# Altium schematic sheet MB_RF.SchDoc
size 420 x 297 mm; Date: 18/12/2022; ApprovedBy: UA3REO; CheckedBy: UA3REO; Author: RU4PN; CompanyName: Wolf Team; DocumentNumber: Wolf2 MainBoard RF; SheetNumber: 6; SheetTotal: 7
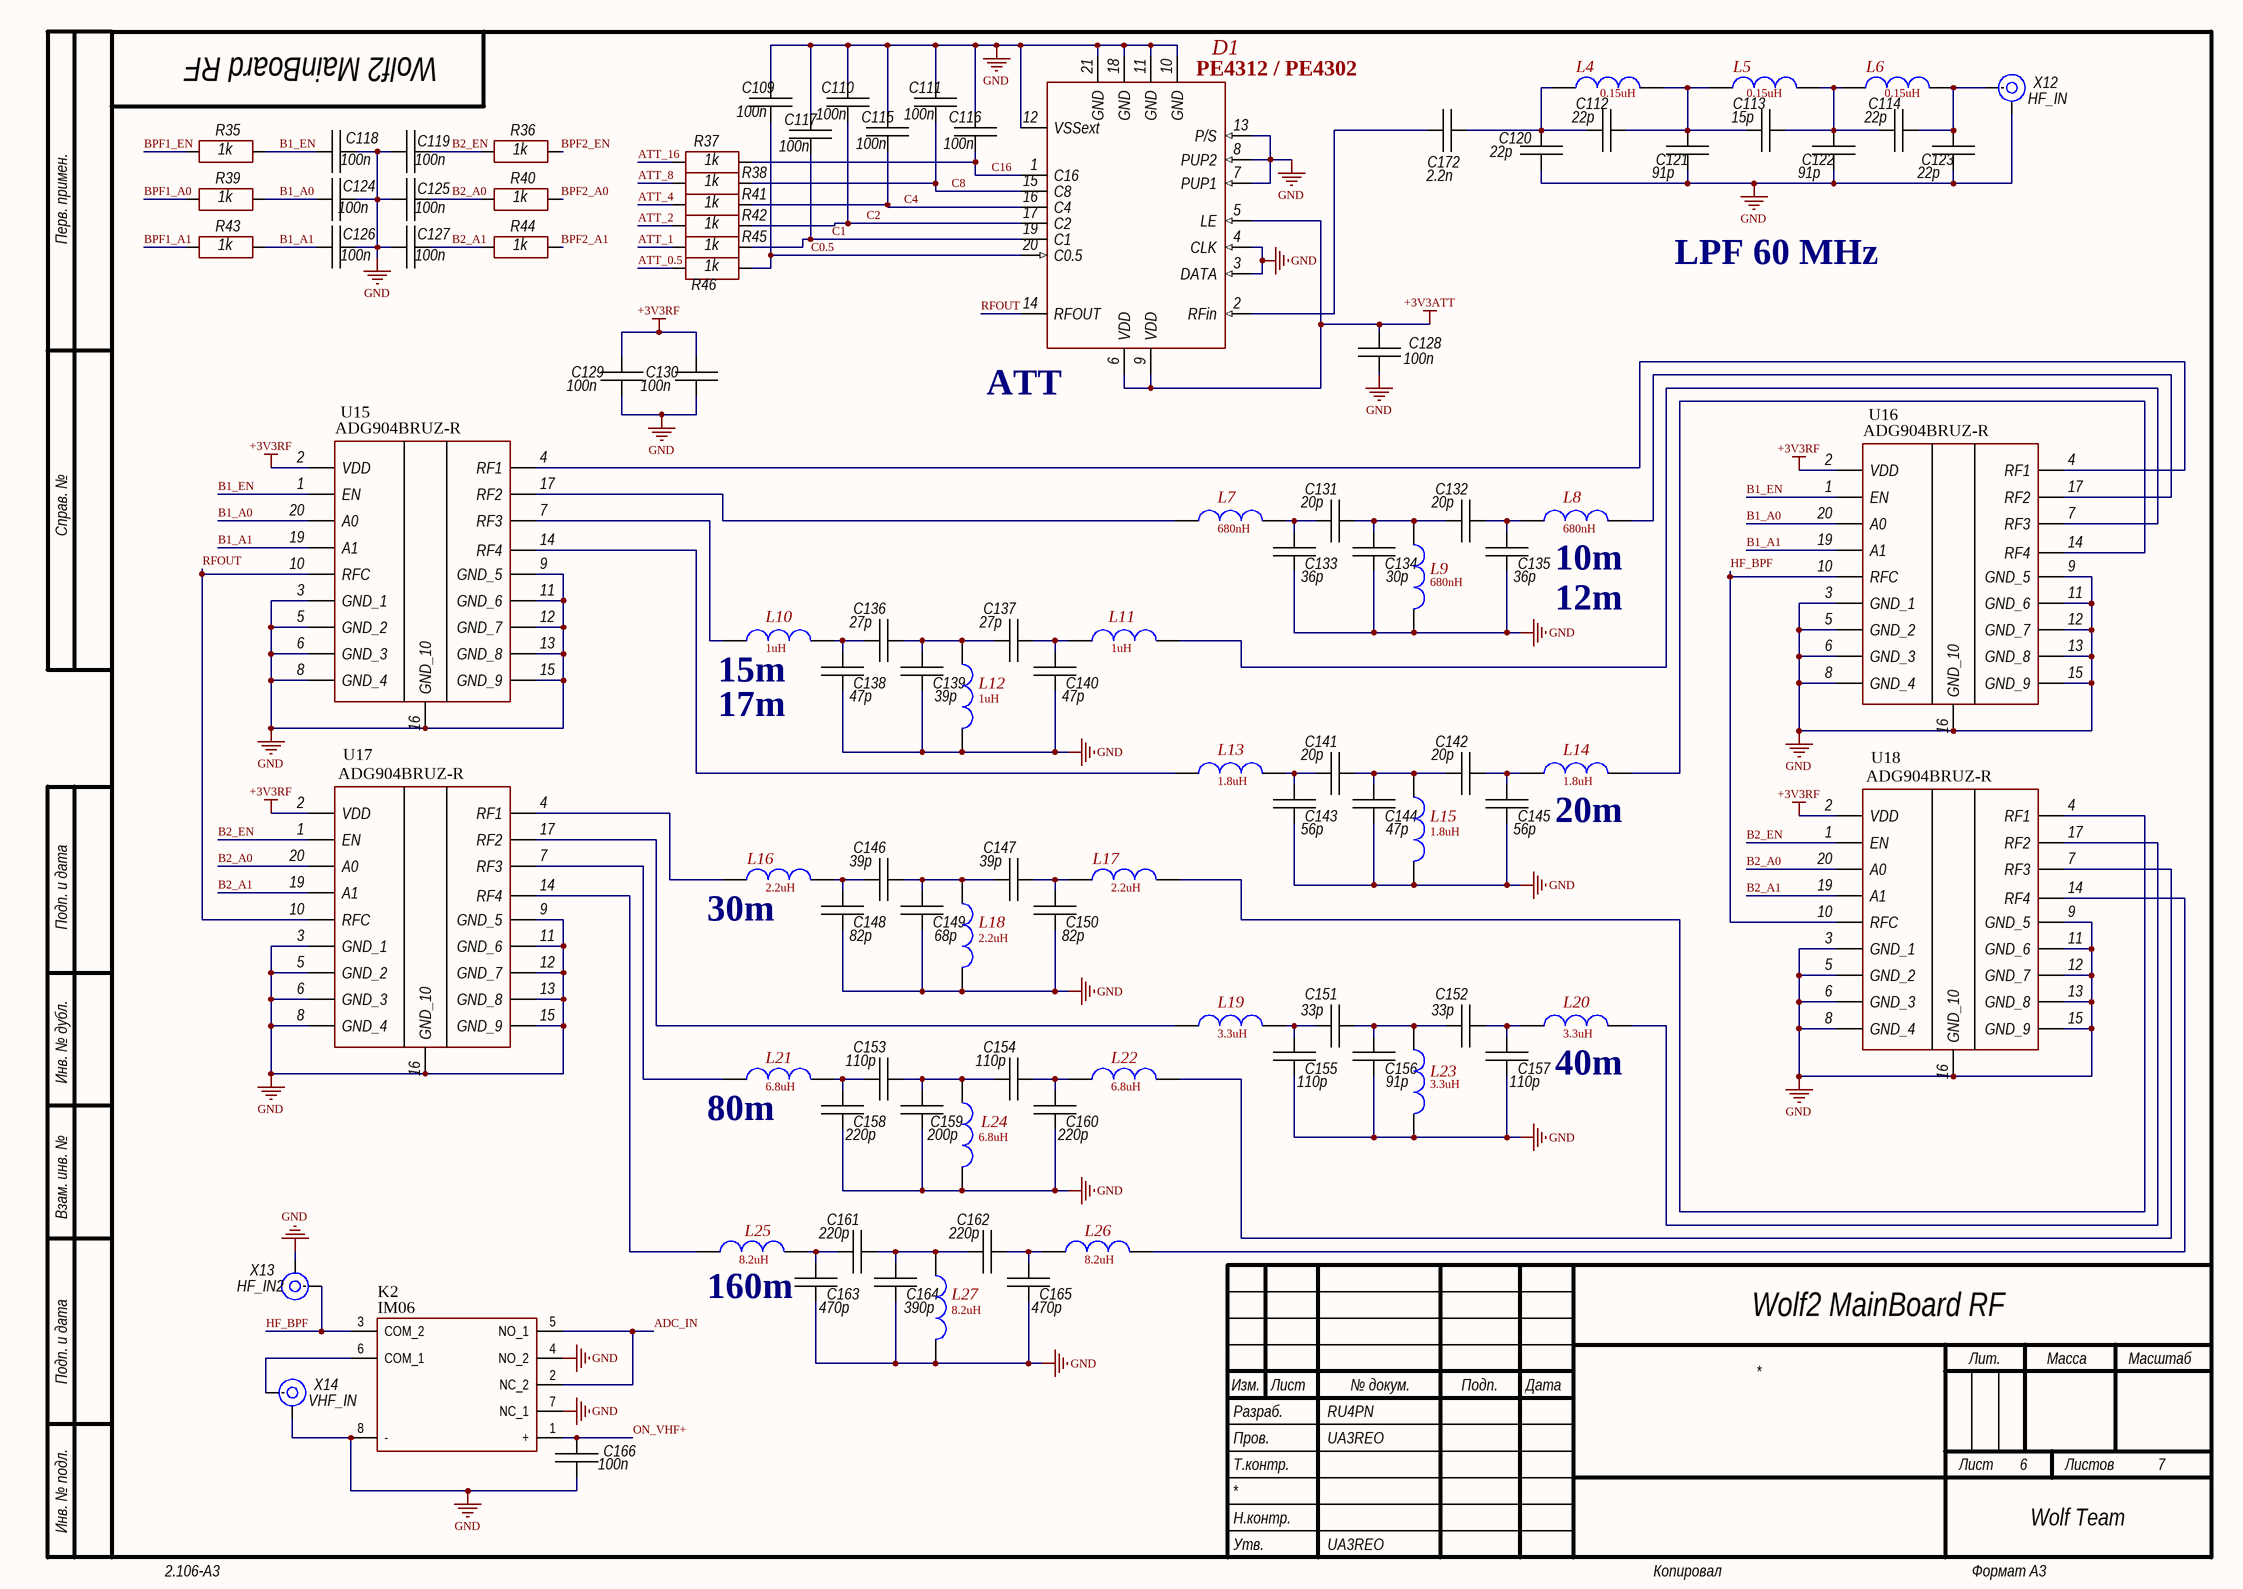
[diagram p0: MB_RF.SchDoc]

## Parts
C109  100n  [CH0805C]
C110  100n  [CH0805C]
C111  100n  [CH0805C]
C112  22p  [CH0805C]
C113  15p  [CH0805C]
C114  22p  [CH0805C]
C115  100n  [CH0805C]
C116  100n  [CH0805C]
C117  100n  [CH0805C]
C118  100n  [CH0805C]
C119  100n  [CH0805C]
C120  22p  [CH0805C]
C121  91p  [CH0805C]
C122  91p  [CH0805C]
C123  22p  [CH0805C]
C124  100n  [CH0805C]
C125  100n  [CH0805C]
C126  100n  [CH0805C]
C127  100n  [CH0805C]
C128  100n  [CH0805C]
C129  100n  [CH0805C]
C130  100n  [CH0805C]
C131  20p  [CH0805C]
C132  20p  [CH0805C]
C133  36p  [CH0805C]
C134  30p  [CH0805C]
C135  36p  [CH0805C]
C136  27p  [CH0805C]
C137  27p  [CH0805C]
C138  47p  [CH0805C]
C139  39p  [CH0805C]
C140  47p  [CH0805C]
C141  20p  [CH0805C]
C142  20p  [CH0805C]
C143  56p  [CH0805C]
C144  47p  [CH0805C]
C145  56p  [CH0805C]
C146  39p  [CH0805C]
C147  39p  [CH0805C]
C148  82p  [CH0805C]
C149  68p  [CH0805C]
C150  82p  [CH0805C]
C151  33p  [CH0805C]
C152  33p  [CH0805C]
C153  110p  [CH0805C]
C154  110p  [CH0805C]
C155  110p  [CH0805C]
C156  91p  [CH0805C]
C157  110p  [CH0805C]
C158  220p  [CH0805C]
C159  200p  [CH0805C]
C160  220p  [CH0805C]
C161  220p  [CH0805C]
C162  220p  [CH0805C]
C163  470p  [CH0805C]
C164  390p  [CH0805C]
C165  470p  [CH0805C]
C166  100n  [CH0805C]
C172  2.2n  [CH0805C]
D1  PE4312 / PE4302  [20-QFN (4x4)]
K2  IM06  [IM06]
L4  0.15uH  [CH0805L]
L5  0.15uH  [CH0805L]
L6  0.15uH  [CH0805L]
L7  680nH  [CH0805L]
L8  680nH  [CH0805L]
L9  680nH  [CH0805L]
L10  1uH  [CH0805L]
L11  1uH  [CH0805L]
L12  1uH  [CH0805L]
L13  1.8uH  [CH0805L]
L14  1.8uH  [CH0805L]
L15  1.8uH  [CH0805L]
L16  2.2uH  [CH0805L]
L17  2.2uH  [CH0805L]
L18  2.2uH  [CH0805L]
L19  3.3uH  [CH0805L]
L20  3.3uH  [CH0805L]
L21  6.8uH  [CH0805L]
L22  6.8uH  [CH0805L]
L23  3.3uH  [CH0805L]
L24  6.8uH  [CH0805L]
L25  8.2uH  [CH0805L]
L26  8.2uH  [CH0805L]
L27  8.2uH  [CH0805L]
R35  1k  [CH0805R]
R36  1k  [CH0805R]
R37  1k  [CH0805R]
R38  1k  [CH0805R]
R39  1k  [CH0805R]
R40  1k  [CH0805R]
R41  1k  [CH0805R]
R42  1k  [CH0805R]
R43  1k  [CH0805R]
R44  1k  [CH0805R]
R45  1k  [CH0805R]
R46  1k  [CH0805R]
U15  ADG904BRUZ-R  [20-TSSOP]
U16  ADG904BRUZ-R  [20-TSSOP]
U17  ADG904BRUZ-R  [20-TSSOP]
U18  ADG904BRUZ-R  [20-TSSOP]
X12  HF_IN  [CON: SMA]
X13  HF_IN2  [CON: SMA]
X14  VHF_IN  [CON: SMA]

## Nets
+3V3ATT: C128.1 D1.5(LE) D1.6(VDD) D1.9(VDD)
+3V3RF: C129.1 C130.1 U15.2(VDD) U16.2(VDD) U17.2(VDD) U18.2(VDD)
GND: C109.1 C110.1 C111.1 C115.1 C116.1 C117.1 C118.2 C119.1 C120.2 C121.2 C122.2 C123.2 C124.2 C125.1 C126.2 C127.1 C128.2 C129.2 C130.2 C133.1 C134.1 C135.1 C138.1 C139.1 C140.1 C143.1 C144.1 C145.1 C148.1 C149.1 C150.1 C155.1 C156.1 C157.1 C158.1 C159.1 C160.1 C163.1 C164.1 C165.1 C166.1 D1.3(DATA) D1.4(CLK) D1.7(PUP1) D1.8(PUP2) D1.10(GND) D1.11(GND) D1.12(VSSext) D1.13(P/S) D1.18(GND) D1.21(GND) K2.4(NO_2) K2.7(NC_1) K2.8(-) L9.1 L12.1 L15.1 L18.1 L23.1 L24.1 L27.1 U15.3(GND_1) U15.5(GND_2) U15.6(GND_3) U15.8(GND_4) U15.9(GND_5) U15.11(GND_6) U15.12(GND_7) U15.13(GND_8) U15.15(GND_9) U15.16(GND_10) U16.3(GND_1) U16.5(GND_2) U16.6(GND_3) U16.8(GND_4) U16.9(GND_5) U16.11(GND_6) U16.12(GND_7) U16.13(GND_8) U16.15(GND_9) U16.16(GND_10) U17.3(GND_1) U17.5(GND_2) U17.6(GND_3) U17.8(GND_4) U17.9(GND_5) U17.11(GND_6) U17.12(GND_7) U17.13(GND_8) U17.15(GND_9) U17.16(GND_10) U18.3(GND_1) U18.5(GND_2) U18.6(GND_3) U18.8(GND_4) U18.9(GND_5) U18.11(GND_6) U18.12(GND_7) U18.13(GND_8) U18.15(GND_9) U18.16(GND_10) X12.2(IN) X13.2(IN) X14.2(IN)
ADC_IN: K2.2(NC_2) K2.5(NO_1)
ATT_0.5: R46.2
ATT_1: R45.2
ATT_2: R42.2
ATT_4: R41.2
ATT_8: R38.2
ATT_16: R37.2
B1_A0: C124.1 R39.1 U15.20(A0) U16.20(A0)
B1_A1: C126.1 R43.1 U15.19(A1) U16.19(A1)
B1_EN: C118.1 R35.1 U15.1(EN) U16.1(EN)
B2_A0: C125.2 R40.2 U17.20(A0) U18.20(A0)
B2_A1: C127.2 R44.2 U17.19(A1) U18.19(A1)
B2_EN: C119.2 R36.2 U17.1(EN) U18.1(EN)
BPF1_A0: R39.2
BPF1_A1: R43.2
BPF1_EN: R35.2
BPF2_A0: R40.1
BPF2_A1: R44.1
BPF2_EN: R36.1
C0.5: C109.2 D1.20(С0.5) R46.1
C1: C117.2 D1.19(C1) R45.1
C2: C110.2 D1.17(C2) R42.1
C4: C115.2 D1.16(C4) R41.1
C8: C111.2 D1.15(C8) R38.1
C16: C116.2 D1.1(C16) R37.1
HF_BPF: K2.3(COM_2) U16.10(RFC) U18.10(RFC) X13.1(IN)
ON_VHF+: C166.2 K2.1(+)
RFOUT: D1.14(RFOUT) U15.10(RFC) U17.10(RFC)
NetC112_1: C112.1 C120.1 C172.2 L4.2
NetC112_2: C112.2 C113.1 C121.1 L4.1 L5.2
NetC113_2: C113.2 C114.1 C122.1 L5.1 L6.2
NetC114_2: C114.2 C123.1 L6.1 X12.1(IN)
NetC131_1: C131.1 C132.2 C134.2 L9.2
NetC131_2: C131.2 C133.2 L7.1
NetC132_1: C132.1 C135.2 L8.2
NetC136_1: C136.1 C137.2 C139.2 L12.2
NetC136_2: C136.2 C138.2 L10.1
NetC137_1: C137.1 C140.2 L11.2
NetC141_1: C141.1 C142.2 C144.2 L15.2
NetC141_2: C141.2 C143.2 L13.1
NetC142_1: C142.1 C145.2 L14.2
NetC146_1: C146.1 C147.2 C149.2 L18.2
NetC146_2: C146.2 C148.2 L16.1
NetC147_1: C147.1 C150.2 L17.2
NetC151_1: C151.1 C152.2 C156.2 L23.2
NetC151_2: C151.2 C155.2 L19.1
NetC152_1: C152.1 C157.2 L20.2
NetC153_1: C153.1 C154.2 C159.2 L24.2
NetC153_2: C153.2 C158.2 L21.1
NetC154_1: C154.1 C160.2 L22.2
NetC161_1: C161.1 C162.2 C164.2 L27.2
NetC161_2: C161.2 C163.2 L25.1
NetC162_1: C162.1 C165.2 L26.2
NetC172_1: C172.1 D1.2(RFin)
NetK2_6: K2.6(COM_1) X14.1(IN)
NetL7_2: L7.2 U15.17(RF2)
NetL8_1: L8.1 U16.17(RF2)
NetL10_2: L10.2 U15.7(RF3)
NetL11_1: L11.1 U16.7(RF3)
NetL13_2: L13.2 U15.14(RF4)
NetL14_1: L14.1 U16.14(RF4)
NetL16_2: L16.2 U17.4(RF1)
NetL17_1: L17.1 U18.4(RF1)
NetL19_2: L19.2 U17.17(RF2)
NetL20_1: L20.1 U18.17(RF2)
NetL21_2: L21.2 U17.7(RF3)
NetL22_1: L22.1 U18.7(RF3)
NetL25_2: L25.2 U17.14(RF4)
NetL26_1: L26.1 U18.14(RF4)
NetU15_4: U15.4(RF1) U16.4(RF1)

## Notes on the sheet
- LPF 60 MHz
- (near D1) ATT
- (near L8) 10m
- 12m
- (near L10) 15m
- (near L10) 17m
- (near L14) 20m
- (near L16) 30m
- (near L21) 80m
- (near L20) 40m
- (near L25) 160m
- Перв. примен.
- Справ. №
- Подп. и дата
- Инв. № дубл.
- Взам. инв. №
- Разраб.
- Изм.
- Лист
- № докум.
- Подп.
- Дата
- Лит.
- Масса
- Масштаб
- Пров.
- Т.контр.
- Листов
- Инв. № подл.
- Утв.
- Н.контр.
- 2.106-A3
- Копировал
- Формат А3

## Library data of the parts
C109-C166 C172 = Capacitor: Manufacturer: *; Model: *; HelpURL: *; ComponentKind: *; Value: *
D1 = PE4312-№1
K2 = IM06-V1
L4-L27 = Inductor-2
R35-R46 = Resistor: Manufacturer: *; Model: *; HelpURL: *; ComponentKind: *; Value: *
X12-X14 = SMA: RF; Model: *; Manufacturer: *; HelpURL: *; ComponentKind: *